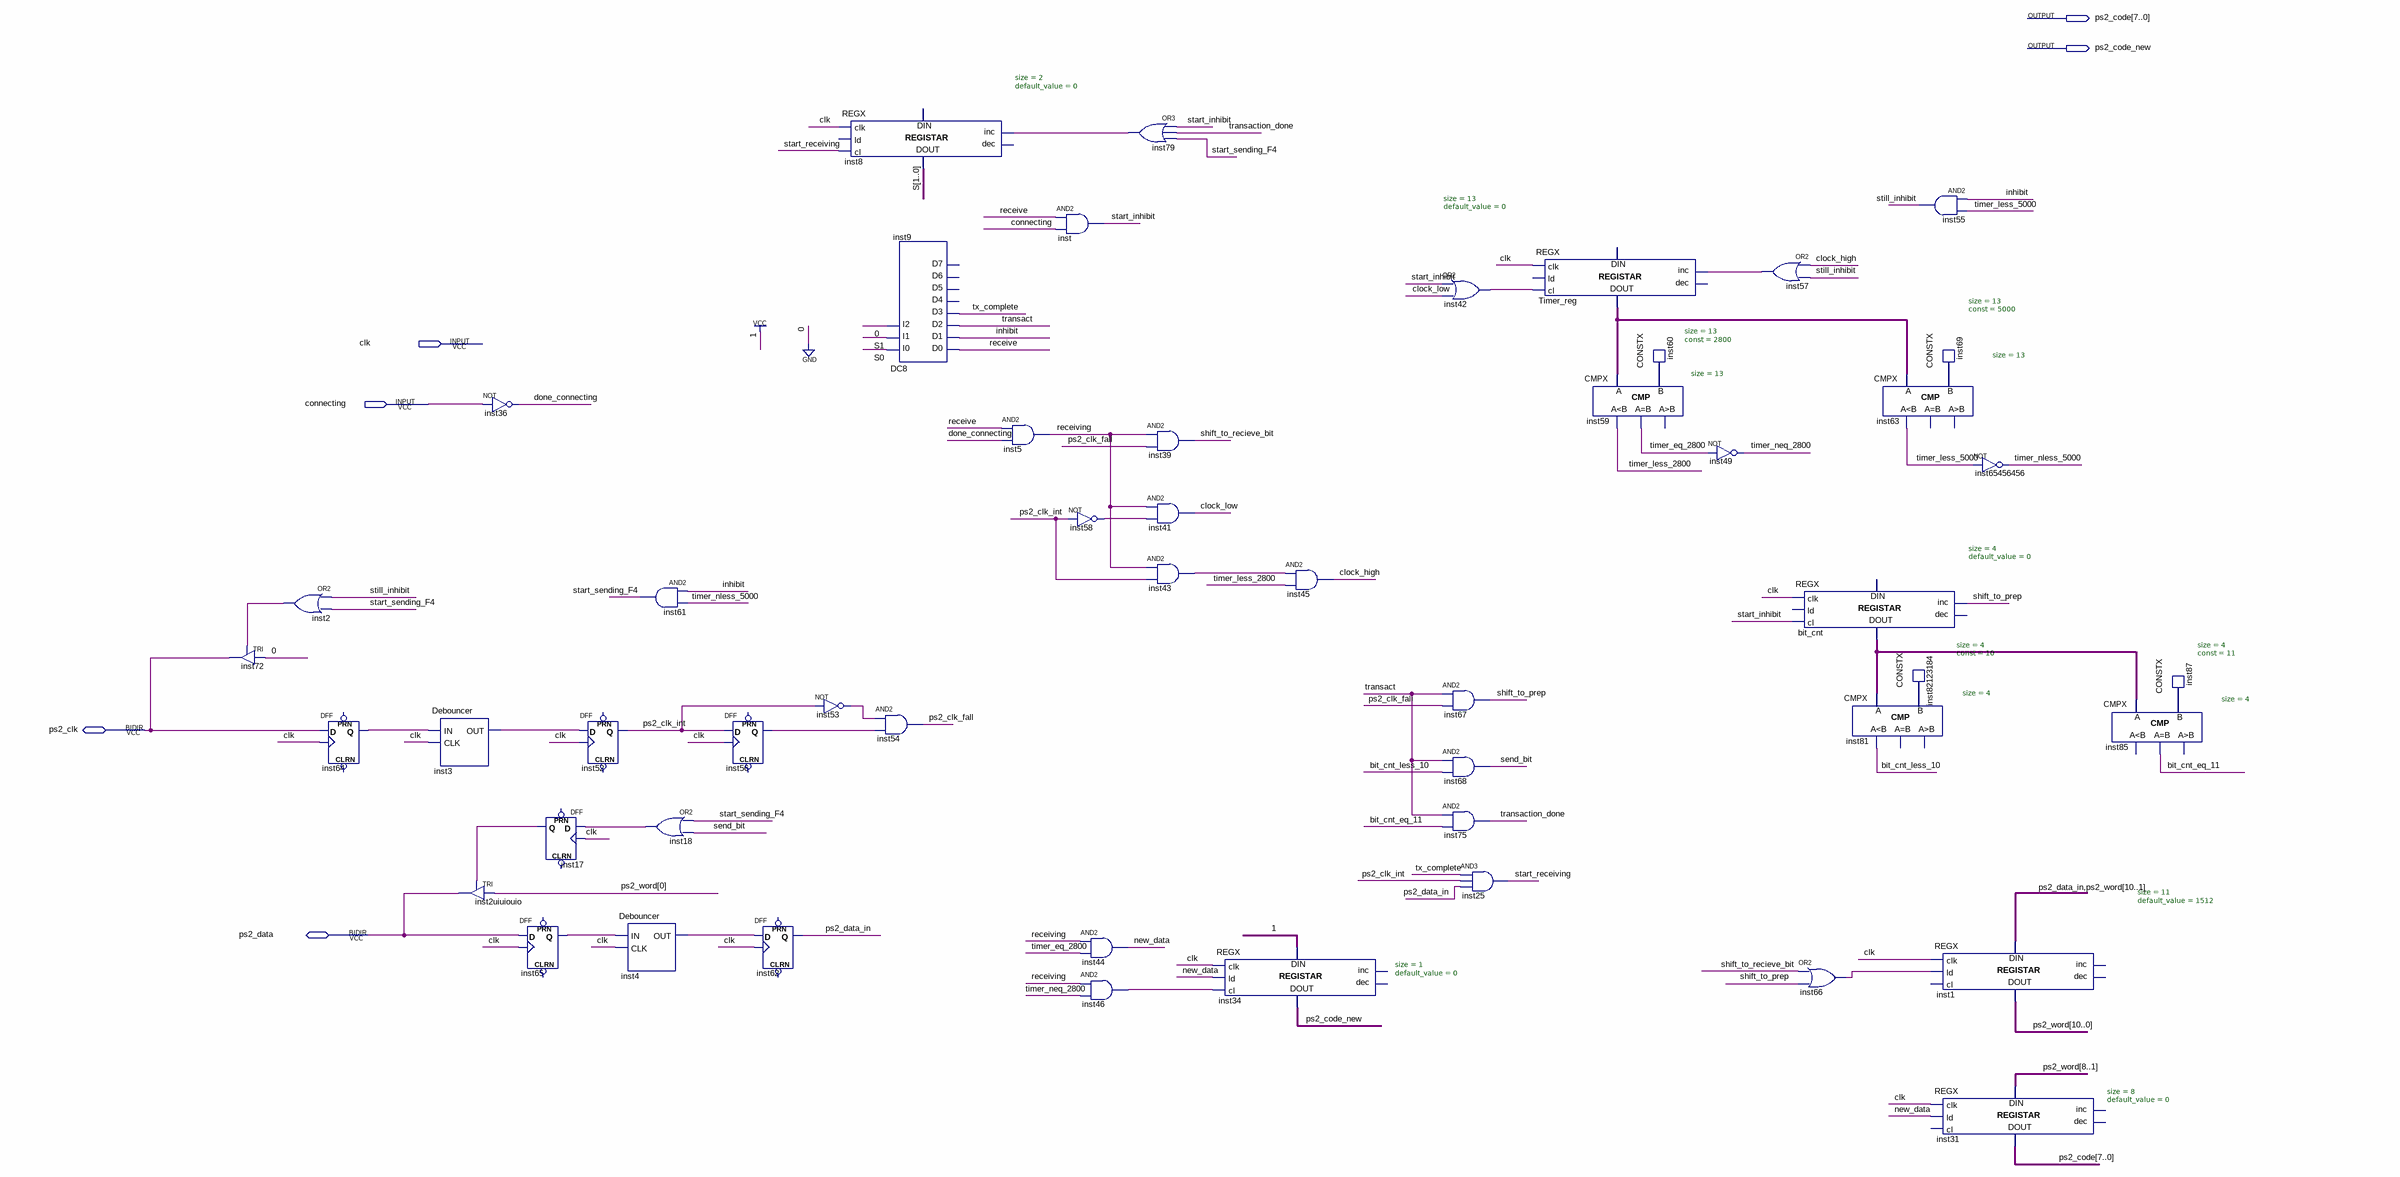
[diagram p0: schematic sheet]
// Quartus schematic MouseTransceiver.bdf as structural Verilog: 51 symbols, 6 pins
module MouseTransceiver (
  input  clk,
  input  connecting,
  inout  ps2_clk,
  inout  ps2_data,
  output [7:0] ps2_code,
  output ps2_code_new
);

  wire bit_cnt_eq_11, bit_cnt_less_10, clock_high, clock_low, done_connecting, inhibit, inst2_out, inst3_out,
       inst4_out, inst17_q, inst18_out, inst42_out, inst43_out, inst46_out, inst53_out, inst56_q, inst57_out,
       inst58_out, inst64_q, inst65_q, inst66_out, inst79_out, new_data, ps2_clk_fall, ps2_clk_int,
       ps2_data_in, receive, receiving, send_bit, shift_to_prep, shift_to_recieve_bit, start_inhibit,
       start_receiving, start_sending_F4, still_inhibit, timer_eq_2800, timer_less_2800, timer_less_5000,
       timer_neq_2800, timer_nless_5000, transact, transaction_done, tx_complete;
  wire [1:0] S;
  wire [3:0] bit_cnt_data_out, inst87_data, inst82123184_data;
  wire [10:0] ps2_word;
  wire [12:0] inst60_data, inst69_data, Timer_reg_data_out;

  TRI inst72 (.IN(1'b0), .OE(inst2_out), .OUT(ps2_clk));
  or inst2 (inst2_out, still_inhibit, start_sending_F4);
  DFF inst64 (.CLK(clk), .D(ps2_clk), .Q(inst64_q));  // open: CLRN, PRN
  Debouncer inst3 (.IN(inst64_q), .CLK(clk), .OUT(inst3_out));
  not inst36 (done_connecting, connecting);
  TRI inst2uiuiouio (.IN(ps2_word[0]), .OE(inst17_q), .OUT(ps2_data));
  DFF inst17 (.CLK(clk), .D(inst18_out), .Q(inst17_q));  // open: CLRN, PRN
  DFF inst65 (.CLK(clk), .D(ps2_data), .Q(inst65_q));  // open: CLRN, PRN
  DFF inst52 (.CLK(clk), .D(inst3_out), .Q(ps2_clk_int));  // open: CLRN, PRN
  and inst61 (start_sending_F4, inhibit, timer_nless_5000);
  Debouncer inst4 (.IN(inst65_q), .CLK(clk), .OUT(inst4_out));
  or inst18 (inst18_out, start_sending_F4, send_bit);
  DFF inst56 (.CLK(clk), .D(ps2_clk_int), .Q(inst56_q));  // open: CLRN, PRN
  DFF inst62 (.CLK(clk), .D(inst4_out), .Q(ps2_data_in));  // open: CLRN, PRN
  not inst53 (inst53_out, ps2_clk_int);
  REGX #(.size(2), .default_value(0)) inst8 (
    .clk(clk), .cl(start_receiving), .inc(inst79_out), .data_out(S));  // open: ld, dec, data_in
  and inst54 (ps2_clk_fall, inst53_out, inst56_q);
  DC8 inst9 (
    .I0(S[0]), .I1(S[1]), .I2(1'b0), .D0(receive), .D1(inhibit), .D2(transact), .D3(tx_complete));  // open: D4, D5, D6, D7
  and inst5 (receiving, receive, done_connecting);
  and inst (start_inhibit, receive, connecting);
  not inst58 (inst58_out, ps2_clk_int);
  and inst44 (new_data, receiving, timer_eq_2800);
  and inst46 (inst46_out, receiving, timer_neq_2800);
  or inst79 (inst79_out, start_inhibit, transaction_done, start_sending_F4);
  and inst39 (shift_to_recieve_bit, receiving, ps2_clk_fall);
  and inst41 (clock_low, receiving, inst58_out);
  and inst43 (inst43_out, receiving, ps2_clk_int);
  REGX #(.size(1), .default_value(0)) inst34 (
    .clk(clk), .ld(new_data), .cl(inst46_out), .data_in(1'b1), .data_out(ps2_code_new));  // open: inc, dec
  and inst45 (clock_high, inst43_out, timer_less_2800);
  or inst42 (inst42_out, start_inhibit, clock_low);
  and inst67 (shift_to_prep, transact, ps2_clk_fall);
  and inst68 (send_bit, transact, bit_cnt_less_10);
  and inst75 (transaction_done, transact, bit_cnt_eq_11);
  and inst25 (start_receiving, tx_complete, ps2_clk_int, ps2_data_in);
  REGX #(.size(13), .default_value(0)) Timer_reg (
    .clk(clk), .cl(inst42_out), .inc(inst57_out), .data_out(Timer_reg_data_out));  // open: ld, dec, data_in
  CMPX #(.size(13)) inst59 (
    .A(Timer_reg_data_out), .B(inst60_data), .ls(timer_less_2800), .eq(timer_eq_2800));  // open: gr
  CONSTX #(.size(13), .\const (2800)) inst60 (.data(inst60_data));
  not inst49 (timer_neq_2800, timer_eq_2800);
  or inst57 (inst57_out, clock_high, still_inhibit);
  REGX #(.size(4), .default_value(0)) bit_cnt (
    .clk(clk), .cl(start_inhibit), .inc(shift_to_prep), .data_out(bit_cnt_data_out));  // open: ld, dec, data_in
  or inst66 (inst66_out, shift_to_recieve_bit, shift_to_prep);
  CMPX #(.size(4)) inst81 (.A(bit_cnt_data_out), .B(inst82123184_data), .ls(bit_cnt_less_10));  // open: eq, gr
  CMPX #(.size(13)) inst63 (.A(Timer_reg_data_out), .B(inst69_data), .ls(timer_less_5000));  // open: eq, gr
  CONSTX #(.size(4), .\const (10)) inst82123184 (.data(inst82123184_data));
  and inst55 (still_inhibit, inhibit, timer_less_5000);
  CONSTX #(.size(13), .\const (5000)) inst69 (.data(inst69_data));
  REGX #(.size(11), .default_value(1512)) inst1 (
    .clk(clk), .ld(inst66_out), .data_in({ps2_data_in, ps2_word[10:1]}), .data_out(ps2_word));  // open: cl, inc, dec
  REGX #(.size(8), .default_value(0)) inst31 (
    .clk(clk), .ld(new_data), .data_in(ps2_word[8:1]), .data_out(ps2_code));  // open: cl, inc, dec
  not inst65456456 (timer_nless_5000, timer_less_5000);
  CMPX #(.size(4)) inst85 (.A(bit_cnt_data_out), .B(inst87_data), .eq(bit_cnt_eq_11));  // open: ls, gr
  CONSTX #(.size(4), .\const (11)) inst87 (.data(inst87_data));
endmodule
